# EasyEDA Pro project ProProject_MSPM0L1306转接板_2024-08-03.epro

# Schematic Schematic1
Create Date: 2024-06-29; Page Name: P1; Project Name: MSPM0L1306转接板; Schematic Name: Schematic1; Update Date: 2024-08-02; Company: 嘉立创EDA; Page Size: A3; Version: V1.0
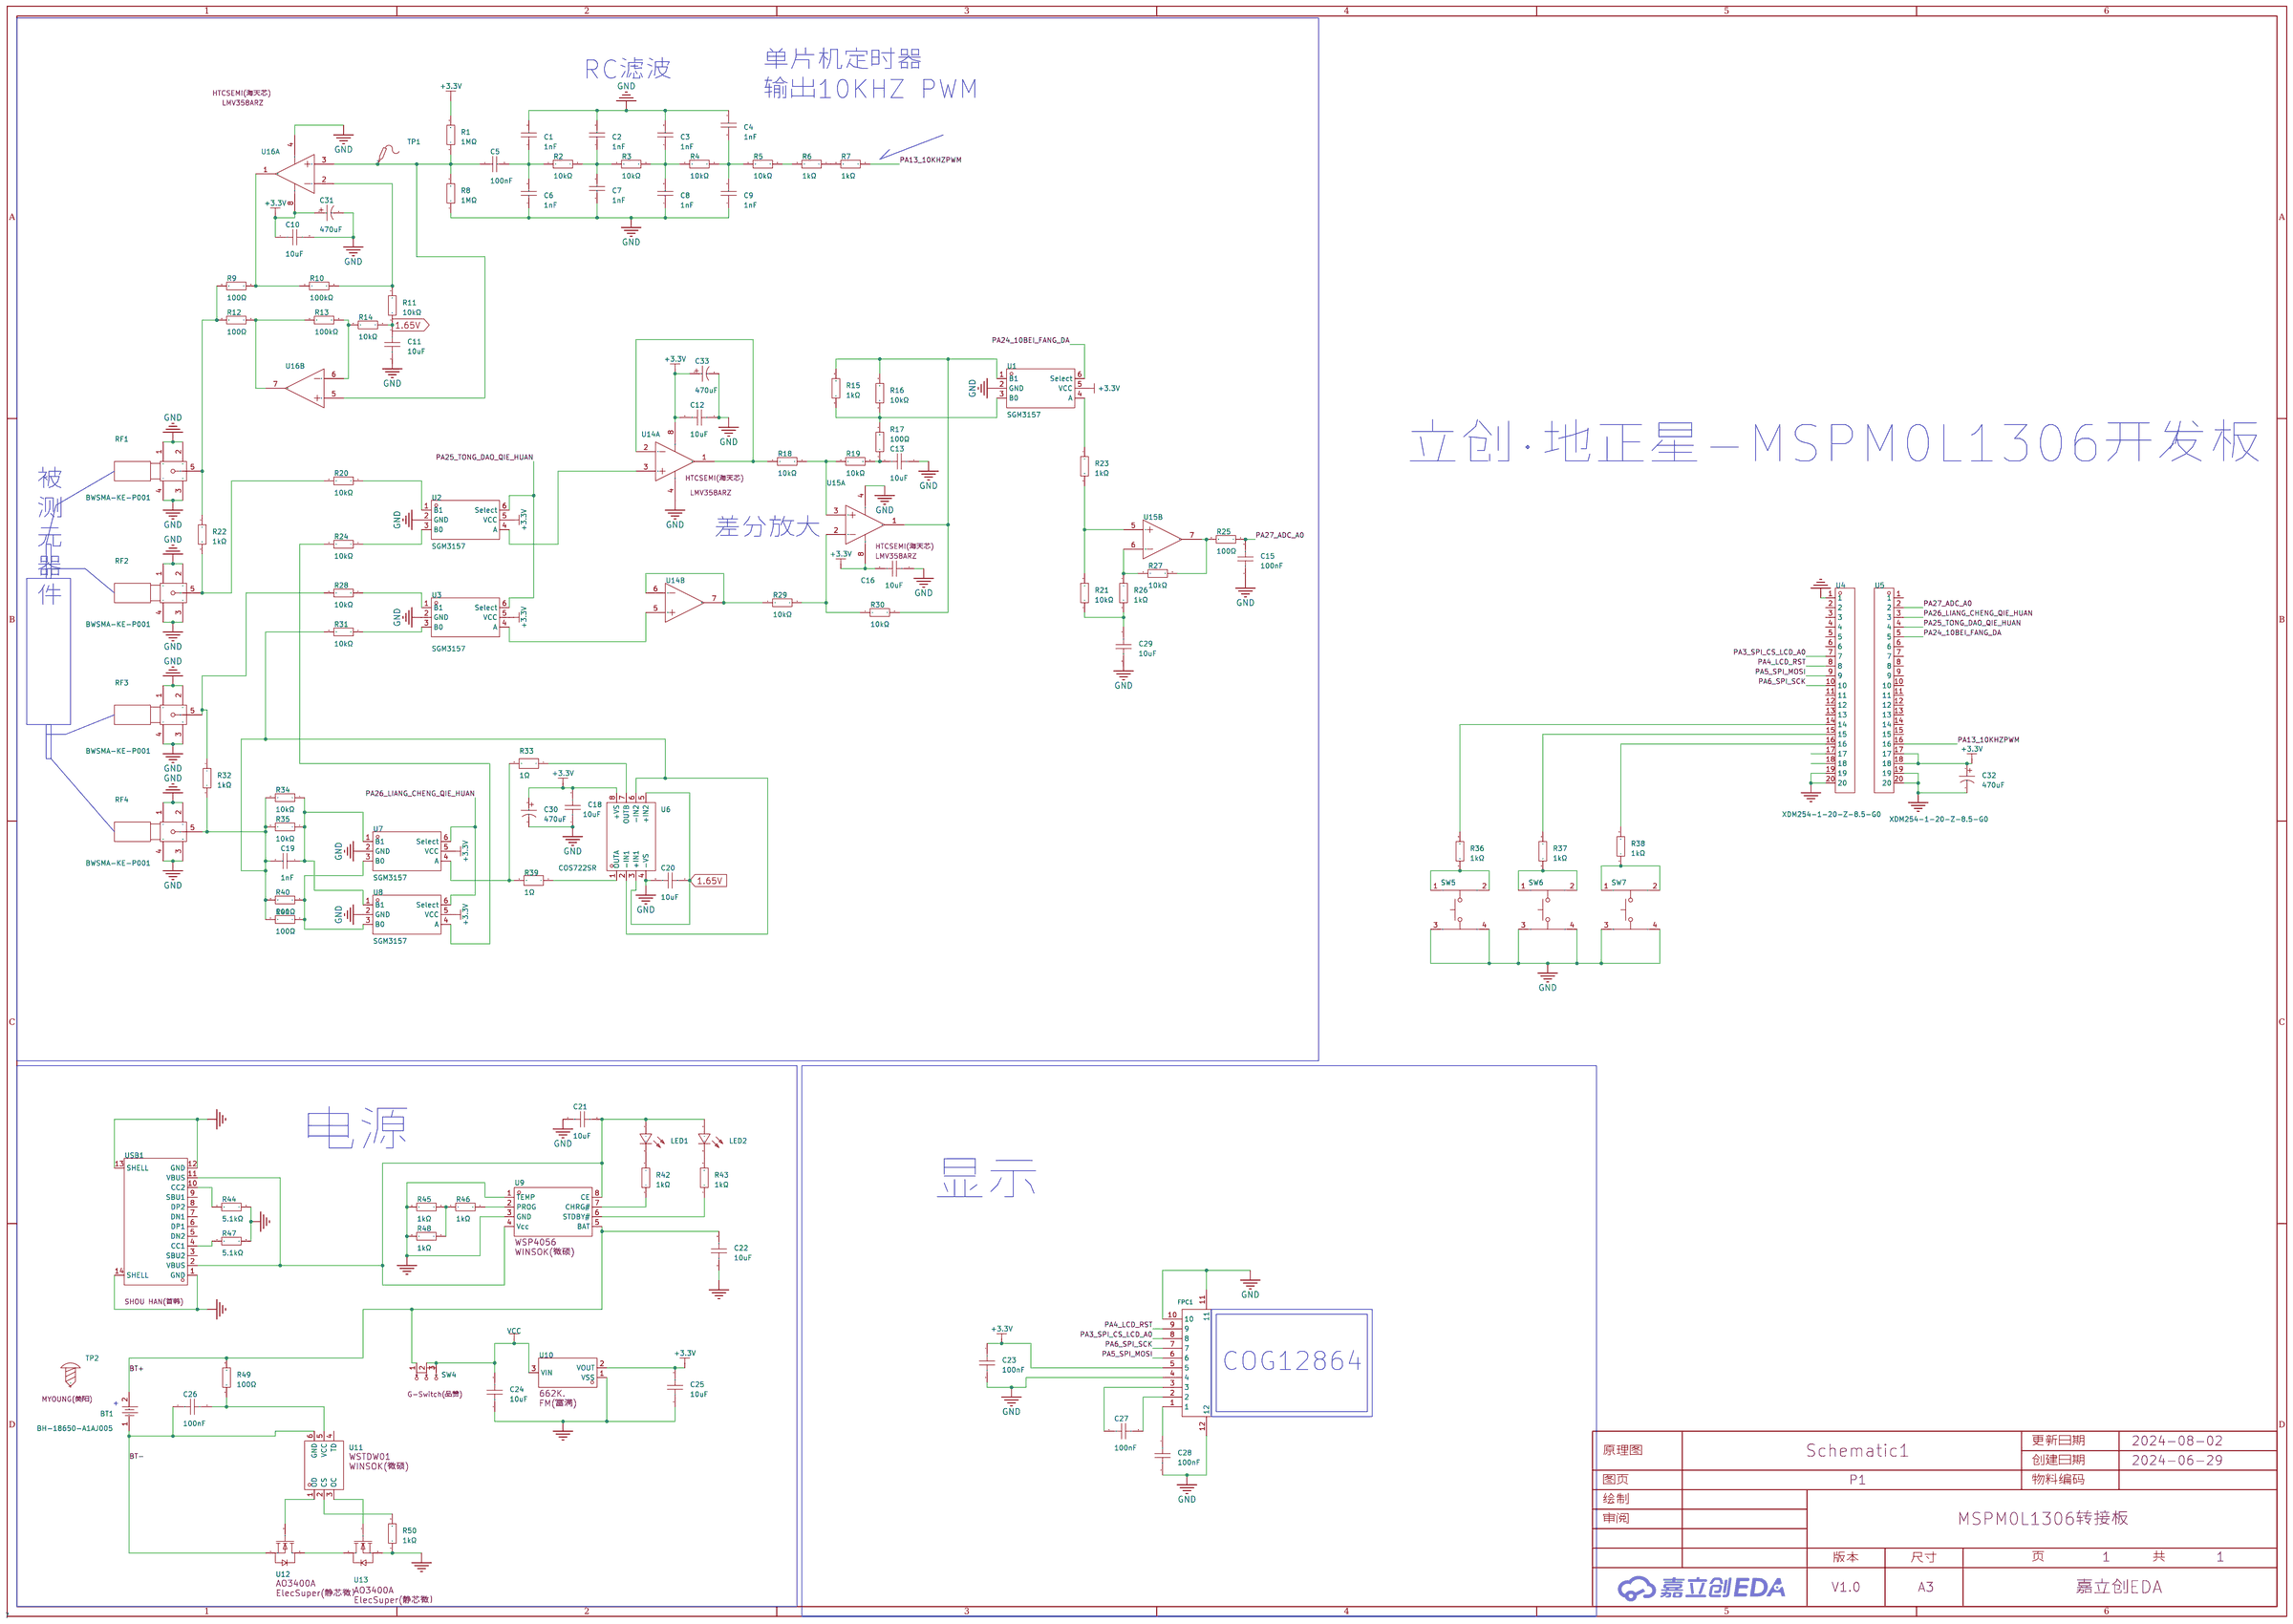
[diagram p0: schematic sheet]

## Parts
BT1  BH-18650-A1AJ005  [BAT-TH_BH-18650-A1AJ005]
C1  1nF  [C0603]
C2  1nF  [C0603]
C3  1nF  [C0603]
C4  1nF  [C0603]
C5  100nF  [C0603]
C6  1nF  [C0603]
C7  1nF  [C0603]
C8  1nF  [C0603]
C9  1nF  [C0603]
C10  10uF  [C0603]
C11  10uF  [C0603]
C12  10uF  [C0603]
C13  10uF  [C0603]
C15  100nF  [C0603]
C16  10uF  [C0603]
C18  10uF  [C0603]
C19  1nF  [C0603]
C20  10uF  [C0603]
C21  10uF  [C0603]
C22  10uF  [C0603]
C23  100nF  [C0603]
C24  10uF  [C0603]
C25  10uF  [C0603]
C26  100nF  [C0603]
C27  100nF  [C0603]
C28  100nF  [C0603]
C29  10uF  [C0603]
C30  470uF  [CAP-TH_BD8.0-P3.50-D0.6-FD]
C31  470uF  [CAP-TH_BD8.0-P3.50-D0.6-FD]
C32  470uF  [CAP-TH_BD8.0-P3.50-D0.6-FD]
C33  470uF  [CAP-TH_BD8.0-P3.50-D0.6-FD]
FPC1  -  [FPC-SMD_10P-P1.0_FGS-XJ-H2.0]
LED1  204-10SURD/S530-A3-L  [LED-TH_BD3.0-P2.54-FD]
LED2  204-10SURD/S530-A3-L  [LED-TH_BD3.0-P2.54-FD]
R1  1MΩ  [R0603]
R2  10kΩ  [R0603]
R3  10kΩ  [R0603]
R4  10kΩ  [R0603]
R5  10kΩ  [R0603]
R6  1kΩ  [R0603]
R7  1kΩ  [R0603]
R8  1MΩ  [R0603]
R9  100Ω  [R0603]
R10  100kΩ  [R0603]
R11  10kΩ  [R0603]
R12  100Ω  [R0603]
R13  100kΩ  [R0603]
R14  10kΩ  [R0603]
R15  1kΩ  [R0603]
R16  10kΩ  [R0603]
R17  100Ω  [R0603]
R18  10kΩ  [R0603]
R19  10kΩ  [R0603]
R20  10kΩ  [R0603]
R21  10kΩ  [R0603]
R22  1kΩ  [R0603]
R23  1kΩ  [R0603]
R24  10kΩ  [R0603]
R25  100Ω  [R0603]
R26  1kΩ  [R0603]
R27  10kΩ  [R0603]
R28  10kΩ  [R0603]
R29  10kΩ  [R0603]
R30  10kΩ  [R0603]
R31  10kΩ  [R0603]
R32  1kΩ  [R0603]
R33  1Ω  [R0603]
R34  10kΩ  [R0603]
R35  10kΩ  [R0603]
R36  1kΩ  [R0603]
R37  1kΩ  [R0603]
R38  1kΩ  [R0603]
R39  1Ω  [R0603]
R40  100Ω  [R0603]
R41  100Ω  [R0603]
R42  1kΩ  [R0603]
R43  1kΩ  [R0603]
R44  5.1kΩ  [R0603]
R45  1kΩ  [R0603]
R46  1kΩ  [R0603]
R47  5.1kΩ  [R0603]
R48  1kΩ  [R0603]
R49  100Ω  [R0603]
R50  1kΩ  [R0603]
RF1  BWSMA-KE-P001  [SMA-SMD_BWSMA-KE-P001]
RF2  BWSMA-KE-P001  [SMA-SMD_BWSMA-KE-P001]
RF3  BWSMA-KE-P001  [SMA-SMD_BWSMA-KE-P001]
RF4  BWSMA-KE-P001  [SMA-SMD_BWSMA-KE-P001]
SW4  SS-12F20-G070  [SW-TH_G-SWITCH_SS-12F20-G070]
SW5  -  [SW-TH_4P-L6.0-W6.0-P3.90-LS6.5]
SW6  -  [SW-TH_4P-L6.0-W6.0-P3.90-LS6.5]
SW7  -  [SW-TH_4P-L6.0-W6.0-P3.90-LS6.5]
TP1  -  [Test-Point-0.5mm]
TP2  -  [M3螺丝]
U1  SGM3157  [SC-70-6_L2.2-W1.3-P0.65-LS2.1-BL]
U2  SGM3157  [SC-70-6_L2.2-W1.3-P0.65-LS2.1-BL]
U3  SGM3157  [SC-70-6_L2.2-W1.3-P0.65-LS2.1-BL]
U4  XDM254-1-20-Z-8.5-G0  [HDR-TH_20P-P2.54-V-F-2]
U5  XDM254-1-20-Z-8.5-G0  [HDR-TH_20P-P2.54-V-F-2]
U6  COS722SR  [SOIC-8_L4.9-W3.9-P1.27-LS6.0-BL]
U7  SGM3157  [SC-70-6_L2.2-W1.3-P0.65-LS2.1-BL]
U8  SGM3157  [SC-70-6_L2.2-W1.3-P0.65-LS2.1-BL]
U9  WSP4056  [SOP-8_L5.1-W3.9-P1.27-LS6.0-BL]
U10  662K.  [SOT-23-3_L2.9-W1.3-P1.90-LS2.4-BR]
U11  WSTDW01  [SOT-23-6_L2.9-W1.6-P0.95-LS2.8-BR]
U12  AO3400A  [SOT-23-3_L3.0-W1.6-P1.90-LS2.8-BR]
U13  AO3400A  [SOT-23-3_L3.0-W1.6-P1.90-LS2.8-BR]
U14  -  [SOP-8_L4.9-W3.9-P1.27-LS6.0-BL]  (sections 1,2)
U15  -  [SOP-8_L4.9-W3.9-P1.27-LS6.0-BL]  (sections 1,2)
U16  -  [SOP-8_L4.9-W3.9-P1.27-LS6.0-BL]  (sections 1,2)
USB1  TYPE-C16PIN2MD(073)  [USB-C-SMD_TYPE-C-6PIN-2MD-073]

## Library data of the parts
BT1 = BH-18650-A1AJ005: 连接器类型:电池盒;适用电池规格:CR18650;触点电镀:镍;工作温度范围:-10℃~+100℃;; LCSC Part Name: 电池盒 适用电池:CR18650; Supplier Part: C5290176; Manufacturer: MYOUNG(美阳); JLCPCB Part Class: 扩展库; Datasheet: https://atta.szlcsc.com/upload/public/pdf/source/20221129/D0CEC1B107B5F52E469FD9B49033E00F.pdf; Supplier: LCSC; Connector Type: 电池盒; Battery Type: CR18650; Contact Plating: 镍; Operating Temperature Range: -10℃~+100℃
C1-C4 C6-C9 C19 = CC0603JRNPO9BN102: 容值:1nF;精度:±5%;额定电压:50V;材质(温度系数):NP0;; LCSC Part Name: 1nF±5%50V; Supplier Part: C106246; Manufacturer: YAGEO(国巨); Supplier Footprint: 0603; JLCPCB Part Class: ExtendedPart; Datasheet: https://atta.szlcsc.com/upload/public/pdf/source/20170505/1493957838062.pdf; Supplier: LCSC; Tolerance: ±5%; Voltage Rated: 50V; Temperature Coefficient: NP0
C5 = 0603B104K500NT: 容值:100nF;精度:±10%;额定电压:50V;材质(温度系数):X7R;; LCSC Part Name: 100nF ±10% 50V; Supplier Part: C30926; Manufacturer: FH(风华); Supplier Footprint: 0603; JLCPCB Part Class: Extended Part; Datasheet: https://atta.szlcsc.com/upload/public/pdf/source/20200305/C486355_26A10D38EF8C2A5C37091D0039909270.pdf; Supplier: LCSC; Tolerance: ±10%; Voltage Rated: 50V; Temperature Coefficient: X7R
C10-C13 C16 C18 C20-C22 C24 C25 C29 = CL10A106KP8NNNC: 容值:10uF;精度:±10%;额定电压:10V;材质(温度系数):X5R;; LCSC Part Name: 10uF ±10% 10V; Supplier Part: C19702; Manufacturer: SAMSUNG(三星); Supplier Footprint: 0603; JLCPCB Part Class: 基础库; Datasheet: https://atta.szlcsc.com/upload/public/pdf/source/20160218/1457707763339.pdf; Supplier: LCSC; Tolerance: ±10%; Voltage Rated: 10V; Temperature Coefficient: X5R
C15 C23 C26-C28 = CC0603KRX7R9BB104: 容值:100nF;精度:±10%;额定电压:50V;材质(温度系数):X7R;; LCSC Part Name: 100nF±10%50V; Supplier Part: C14663; Manufacturer: YAGEO(国巨); Supplier Footprint: 0603; JLCPCB Part Class: BasicPart; Datasheet: https://atta.szlcsc.com/upload/public/pdf/source/20180910/C282072_33301C7F631E79921B82A8DAC6BCC5B3.pdf; Supplier: LCSC; Tolerance: ±10%; Voltage Rated: 50V; Temperature Coefficient: X7R
C30-C33 = KM477M016F12RR0VH2FP0: 容值:470uF;精度:±20%;额定电压:16V;; LCSC Part Name: 470uF±20%16V; Supplier Part: C28067; Manufacturer: CX(承兴); Supplier Footprint: 插件,D8xL12mm; JLCPCB Part Class: ExtendedPart; Datasheet: https://atta.szlcsc.com/upload/public/pdf/source/20211027/06D6BA3719C264B639DC286D935D03EA.pdf; Supplier: LCSC; Tolerance: ±20%; Rated Voltage: 16V; φD: 8mm; L: 12mm; Lead Spacing: 3.5mm; Lifetime @ Temp: 2000hrs@105℃
FPC1 = AFA01-S10FCA-00: 间距:1mm;触点数量:10;锁定特性:翻盖式;安装类型:卧贴;触点类型:下接;; LCSC Part Name: FPC1.0MM10P翻盖式H2.0mm下接; Supplier Part: C262756; Manufacturer: JS(钜硕电子); Supplier Footprint: P=1mm; JLCPCB Part Class: ExtendedPart; Supplier: LCSC; Pitch: 1mm; Number of Contacts: 10; Locking Feature: 翻盖式; Mounting Type: 卧贴; Contact Type: 下接; Height Above Board: 2mm; FFC, FCB Thickness: 0.3mm~0.3mm
LED1 LED2 = 204-10SURD/S530-A3-L: 发光颜色:红灯;二极管配置:-;主波长:624nm;色温:-;功率:60mW;安装方式:-;; LCSC Part Name: 红灯; Supplier Part: C99771; Manufacturer: EVERLIGHT(亿光); Supplier Footprint: 插件,D=3mm; JLCPCB Part Class: ExtendedPart; Datasheet: https://atta.szlcsc.com/upload/public/pdf/source/20170504/1493866972127.pdf; Supplier: LCSC; Emitted Color: 红灯; Lens Color: 雾状红; Dominant Wavelength: 624nm; Peak Wavelength: 632nm; Forward Current: 20mA; Power Dissipation: 60mW; Viewing Angle: 40°; Operating Temperature: -40℃~+85℃; Lamp Holder Type: 3mm圆形灯头
R1 R8 = 0603WAF1004T5E: 电阻类型:厚膜电阻;阻值:1MΩ;精度:±1%;功率:100mW;; LCSC Part Name: 1MΩ±1%100mW; Supplier Part: C22935; Manufacturer: UNI-ROYAL(厚声); Supplier Footprint: 0603; JLCPCB Part Class: BasicPart; Datasheet: https://atta.szlcsc.com/upload/public/pdf/source/20200306/C422600_1E6D84923E4A46A82E41ADD87F860B5C.pdf; Supplier: LCSC; Type: 厚膜电阻; Tolerance: ±1%; Power(Watts): 100mW; Temperature Coefficient: ±100ppm/℃; Overload Voltage (Max): 75V; Operating Temperature Range: -55℃~+155℃
R2-R5 R11 R14 R16 R18-R21 R24 R27-R31 R34 R35 R44 R47 = RC0603FR-0710KL: 电阻类型:厚膜电阻;阻值:10kΩ;精度:±1%;功率:100mW;; LCSC Part Name: 10kΩ±1%100mW; Supplier Part: C98220; Manufacturer: YAGEO(国巨); Supplier Footprint: 0603; JLCPCB Part Class: ExtendedPart; Datasheet: https://atta.szlcsc.com/upload/public/pdf/source/20170522/1495423494387.pdf; Supplier: LCSC; Type: 厚膜电阻; Tolerance: ±1%; Power(Watts): 100mW; Temperature Coefficient: ±100ppm/℃; Overload Voltage (Max): 75V; Operating Temperature Range: -55℃~+155℃
R6 R7 R15 R22 R23 R26 R32 R36-R38 R42 R43 R45 R46 R48 R50 = RC0603FR-071KL: 电阻类型:厚膜电阻;阻值:1kΩ;精度:±1%;功率:100mW;; LCSC Part Name: 1kΩ±1%100mW; Supplier Part: C22548; Manufacturer: YAGEO(国巨); Supplier Footprint: 0603; JLCPCB Part Class: ExtendedPart; Datasheet: https://atta.szlcsc.com/upload/public/pdf/source/20180312/7BD3618A8B6324EA6280B0497A051AB7.pdf; Supplier: LCSC; Type: 厚膜电阻; Tolerance: ±1%; Power(Watts): 100mW; Temperature Coefficient: ±100ppm/℃; Overload Voltage (Max): 75V; Operating Temperature Range: -55℃~+155℃
R9 R12 R17 R25 R40 R41 R49 = RC0603FR-07100RL: 电阻类型:厚膜电阻;阻值:100Ω;精度:±1%;功率:100mW;; LCSC Part Name: 100Ω±1%100mW; Supplier Part: C105588; Manufacturer: YAGEO(国巨); Supplier Footprint: 0603; JLCPCB Part Class: ExtendedPart; Datasheet: https://atta.szlcsc.com/upload/public/pdf/source/20170428/1493376742308.pdf; Supplier: LCSC; Type: 厚膜电阻; Tolerance: ±1%; Power(Watts): 100mW; Temperature Coefficient: ±100ppm/℃; Overload Voltage (Max): 75V; Operating Temperature Range: -55℃~+155℃
R10 R13 = RC0603FR-07100KL: 电阻类型:厚膜电阻;阻值:100kΩ;精度:±1%;功率:100mW;; LCSC Part Name: 100kΩ±1%100mW; Supplier Part: C14675; Manufacturer: YAGEO(国巨); Supplier Footprint: 0603; JLCPCB Part Class: ExtendedPart; Datasheet: https://atta.szlcsc.com/upload/public/pdf/source/20140324/1457707028752.pdf; Supplier: LCSC; Type: 厚膜电阻; Tolerance: ±1%; Power(Watts): 100mW; Temperature Coefficient: ±100ppm/℃; Overload Voltage (Max): 75V; Operating Temperature Range: -55℃~+155℃
R33 R39 = SCR0603F1R: 阻值:1Ω;精度:±1%;; LCSC Part Name: 1Ω ±1%; Supplier Part: C3016186; Manufacturer: VO(翔胜); Supplier Footprint: 0603; JLCPCB Part Class: Extended Part; Datasheet: https://atta.szlcsc.com/upload/public/pdf/source/20220513/247AF9639BA21CF93567DC289CCC6A22.pdf; Supplier: LCSC; Tolerance: ±1%
RF1-RF4 = BWSMA-KE-P001: 连接器类型:板端;接口类型:内孔;端口数量:1;接口直径:5.2mm;接口长度/高度:-;频率-最大值:-;射频系列:SMA;阻抗:50Ω;样式:偏脚;工作温度范围:-;; LCSC Part Name: 内孔 SMA 偏脚; Supplier Part: C496550; Manufacturer: BAT WIRELESS(蝙蝠无线); Supplier Footprint: 插件; JLCPCB Part Class: 扩展库; Datasheet: https://atta.szlcsc.com/upload/public/pdf/source/20240320/28FD502871C976DFF213ABFCF2A0ED51.pdf; Supplier: LCSC; Connector Type: 板端; Interface Type: 内孔; Number of Ports: 1; Interface Diameter: 5.2mm; RF Series: SMA; Impedance: 50Ω; Style: 偏脚
SW4 = SS-12F20-G070: 额定电流(DC):500mA;额定电压(DC):250V;电路结构:单刀双掷;安装方式:直插;机械寿命:-;开关颜色:黑色;; LCSC Part Name: 柄长7mm直插两档滑动开关; Supplier Part: C2848914; Manufacturer: G-Switch(品赞); Supplier Footprint: 插件; JLCPCB Part Class: ExtendedPart; Datasheet: https://atta.szlcsc.com/upload/public/pdf/source/20210825/E0137178672C137814869A76188F885C.pdf; Supplier: LCSC; Current Rating (DC): 500mA; Voltage Rating (DC): 250V; Circuit: 单刀双掷; Mounting Style: 直插; Actuator Color: 黑色; Actuator Style: 矩形柱状; Pin Style: PC引脚; Switch Length: 11.5mm; Switch Width: 5.8mm; Switch Height: 12mm
SW5-SW7 = 1TS005A-2500-5001: 触点电流:50mA;额定电压(DC):12V;额定功率:0.6W;绝缘电阻:100MΩ;电路结构:单刀单掷;安装方式:直插;带灯:无;作用力:250gf@±50gf;机械寿命:7万次;带支架:否;; LCSC Part Name: 6*6*5mm直插轻触开关; Supplier Part: C255811; Manufacturer: HYP(鸿源精密); Supplier Footprint: 插件,6x6mm; JLCPCB Part Class: ExtendedPart; Datasheet: https://atta.szlcsc.com/upload/public/pdf/source/20180720/C255811_DA12C4E3C20854D48E888AEA64926F5F.pdf; Supplier: LCSC; Contact Current: 50mA; Voltage Rating (DC): 12V; Power Rating: 0.6W; Insulation Resistance: 100MΩ; Circuit: 单刀单掷; Mounting Style: 直插; Actuator Style: 圆形按钮; Actuator/Cap Color: 黑色; With Lamp: 无; Operating Force: 250gf@±50gf; Mechanical Life: 7万次; Operating Temperature: -40℃~+90℃; Pin Style: PC引脚; Switch Length: 6mm; Switch Width: 6mm; Switch Height: 5mm; Strike Gundam: 否
TP1 = Test-Point: Test Point 测试点
TP2 = M3螺丝: Supplier Footprint: 插件
U1-U3 U7 U8 = SGM3157: 开关电路:-;; LCSC Part Name: 二选一模拟开关电路; Supplier Part: C394901; Manufacturer: UMW(广东友台半导体); Supplier Footprint: SC-70-6; JLCPCB Part Class: ExtendedPart; Datasheet: https://atta.szlcsc.com/upload/public/pdf/source/20220825/163C0318ED3C3969CBD04552300499AD.pdf; Supplier: LCSC
U4 U5 = XDM254-1-20-Z-8.5-G0: 插孔结构:1x20P;间距:2.54mm;圆孔/方孔:方孔;安装类型:直插;排数:单排;总孔位数:20P;额定电流:3A;插孔方向:顶部;塑高:8.5mm;工作温度范围:-40℃~+105℃;; LCSC Part Name: 1x20P 间距:2.54mm 直插; Supplier Part: C19268713; Manufacturer: XUNDA(讯答); Supplier Footprint: 插件,P=2.54mm; JLCPCB Part Class: Extended Part; Datasheet: https://atta.szlcsc.com/upload/public/pdf/source/20231121/1B5B5C08BA46A4182275D1400A0063D9.pdf; Supplier: LCSC; Holes Structure: 1x20P; Pitch: 2.54mm; Circular Hole / Square Hole: 方孔; Mounting Type: 直插; Number of Rows: 单排; Number of Holes: 20P; Current Rating (Max): 3A; Holes Direction: 顶部; Insulation Height: 8.5mm; Operating Temperature Range: -40℃~+105℃
U6 = COS722SR: 放大器数:双路;增益带宽积(GBP):10MHz;输入失调电压(Vos):5mV;压摆率(SR):7.5V/us;; Supplier Part: C693063; Manufacturer: COSINE(科山芯创); Supplier Footprint: SOIC-8; JLCPCB Part Class: 扩展库; Datasheet: https://atta.szlcsc.com/upload/public/pdf/source/20200629/C693056_2991DE5392421DDCA1474C8C5608148D.pdf; Supplier: LCSC; Number of Circuits: 双路; Gain Bandwidth Product(GBP): 10MHz; Voltage - Input Offset(Vos): 5mV; Slew Rate(SR): 7.5V/us; Supply Current: 650uA
U9 = WSP4056: Supplier Part: C2985892; Manufacturer: WINSOK(微硕); Supplier Footprint: SOP-8; JLCPCB Part Class: ExtendedPart; Supplier: LCSC
U10 = 662K.: 输出类型:-;; LCSC Part Name: 662K; Supplier Part: C841298; Manufacturer: FM(富满); Supplier Footprint: SOT23-3; JLCPCB Part Class: ExtendedPart; Datasheet: https://atta.szlcsc.com/upload/public/pdf/watermark/20200922/C841298_3E220732626B158CD6AC195AF78C7FB8.pdf; Supplier: LCSC
U11 = WSTDW01: 充电电池的类型:-;电池单元组数:-;最大充电电流:-;充满的电池组电压:-;最大供应电压:-;; Supplier Part: C86873; Manufacturer: WINSOK(微硕); Supplier Footprint: SOT-23-6; JLCPCB Part Class: ExtendedPart; Datasheet: https://atta.szlcsc.com/upload/public/pdf/source/20161110/1478743415995.pdf; Supplier: LCSC
U12 U13 = AO3400A_C5224194: 类型:N沟道;漏源电压(Vdss):30V;连续漏极电流(Id):6A;功率(Pd):1.4W;导通电阻(RDS(on)@Vgs,Id):19mΩ@10V,6.0A;; LCSC Part Name: N沟道30V6A; Supplier Part: C5224194; Manufacturer: ElecSuper(静芯微）; Supplier Footprint: SOT-23-3L; JLCPCB Part Class: ExtendedPart; Datasheet: https://atta.szlcsc.com/upload/public/pdf/source/20221027/D95D9171DDBB7BB324532F3AF1EADB7E.pdf; Supplier: LCSC; Type: N沟道; Drain Source Voltage (Vdss): 30V; Continuous Drain Current (Id): 6A; Power Dissipation (Pd): 1.4W; Drain Source On Resistance (RDS(on)@Vgs,Id): 19mΩ@10V,6.0A; Gate Threshold Voltage (Vgs(th)@Id): 1V@250uA
U14-U16 = LMV358ARZ: CMOS低功耗双路运算放大器; Supplier Part: C2928823; Manufacturer: HTCSEMI(海天芯); Supplier Footprint: SOP-8; JLCPCB Part Class: ExtendedPart; Datasheet: https://atta.szlcsc.com/upload/public/pdf/source/20220114/2D4B849A76DE33264688A93B3A90A0F8.pdf; Supplier: LCSC
USB1 = TYPE-C 16PIN 2MD(073): 连接器类型:Type-C;标准:-;公母:母座;触点数量:16;端口数量:1;安装方式:卧贴;额定电流 - 电源:5A;工作温度范围:-25℃~+85℃;; LCSC Part Name: TYPE-C母座16P4脚插件带定位柱不锈钢外壳2次模顶; Supplier Part: C2765186; Manufacturer: SHOU HAN(首韩); Supplier Footprint: SMD; JLCPCB Part Class: ExtendedPart; Datasheet: https://atta.szlcsc.com/upload/public/pdf/source/20211123/39B17C16241EAC15C5E277BDA434118E.pdf; Supplier: LCSC; Connector Type: Type-C; Gender: 母座; Number of Contacts: 16; Number of Ports: 1; Mounting Style: 卧贴; Current Rating - Power (Max): 5A; Operating Temperature Range: -25℃~+85℃

## Nets
1.65V: C11.1 C20.1 R11.1 R14.1 U6.3(+IN1) U6.5(+IN2)
+3.3V: C10.1 C12.2 C16.2 C18.2 C23.1 C25.2 C30.1 C31.1 C32.1 C33.1 FPC1.5 R1.2 U1.5(VCC) U2.5(VCC) U3.5(VCC) U5.17 U5.18 U6.8(+VS) U7.5(VCC) U8.5(VCC) U10.2(VOUT) U14.8(VCC) U15.8(VCC) U16.8(VCC)
GND: C1.2 C2.2 C3.2 C4.2 C6.1 C7.1 C8.1 C9.1 C10.2 C11.2 C12.1 C13.2 C15.1 C16.1 C18.1 C20.2 C21.1 C22.1 C23.2 C24.1 C25.1 C28.2 C29.2 C30.2 C31.2 C32.2 C33.2 FPC1.4 FPC1.10 FPC1.11 FPC1.12 R8.1 R44.2 R45.2 R47.2 R48.2 R50.1 RF1.1 RF1.2 RF1.3 RF1.4 RF2.1 RF2.2 RF2.3 RF2.4 RF3.1 RF3.2 RF3.3 RF3.4 RF4.1 RF4.2 RF4.3 RF4.4 SW5.3 SW5.4 SW6.3 SW6.4 SW7.3 SW7.4 U1.2(GND) U2.2(GND) U3.2(GND) U4.1 U4.19 U4.20 U5.19 U5.20 U6.4(-VS) U7.2(GND) U8.2(GND) U9.1(TEMP) U9.3(GND) U10.1(VSS) U13.2(S) U14.4(GND) U15.4(GND) U16.4(GND) USB1.1(GND) USB1.12(GND) USB1.13(SHELL) USB1.14(SHELL)
VCC: C24.2 SW4.2 SW4.3 U10.3(VIN)
BT+: BT1.2 C22.2 R49.2 SW4.1 U9.5(BAT)
BT-: BT1.1 C26.1 U11.6(GND) U12.2(S)
PA3_SPI_CS_LCD_A0: FPC1.8 U4.7
PA4_LCD_RST: FPC1.9 U4.8
PA5_SPI_MOSI: FPC1.6 U4.9
PA6_SPI_SCK: FPC1.7 U4.10
PA13_10KHZPWM: R7.1 U5.16
PA24_10BEI_FANG_DA: U1.6(Select) U5.5
PA25_TONG_DAO_QIE_HUAN: U2.6(Select) U3.6(Select) U5.4
PA26_LIANG_CHENG_QIE_HUAN: U5.3 U7.6(Select) U8.6(Select)
PA27_ADC_A0: C15.2 R25.1 U5.2
$1N4458: R29.1 U14.6(IN2-) U14.7(OUT2)
$1N4459: R18.1 U14.1(OUT) U14.2(IN1-)
$1N4471: R29.2 R30.1 U15.2(IN1-)
$1N5388: C2.1 C7.2 R2.2 R3.1
$1N5389: C3.1 C8.2 R3.2 R4.1
$1N5390: C4.1 C9.2 R4.2 R5.1
$1N5392: C1.1 C5.2 C6.2 R2.1
$1N5393: R5.2 R6.2
$1N5453: R9.1 R10.1 U16.1(OUT)
$1N5457: R10.2 R11.2 U16.2(IN1-)
$1N5553: R13.2 R14.2 U16.6(IN2-)
$1N5656: R12.1 R13.1 U16.7(OUT2)
$1N7059: U12.3(D) U13.3(D)
$1N7060: U11.1(OD) U12.1(G)
$1N7061: U11.3(OC) U13.1(G)
$1N7062: R50.2 U11.2(CS)
$1N7064: R46.1 U9.2(PROG)
$1N7066: R42.1 U9.7(CHRG#)
$1N7067: R43.1 U9.6(STDBY#)
$1N7068: R47.1 USB1.4(CC1)
$1N7069: R44.1 USB1.10(CC2)
$1N7073: C26.2 R49.1 U11.5(VCC)
$1N7080: R45.1 R46.2 R48.1
$1N7081: C21.2 LED1.1(A) LED2.1(A) U9.4(Vcc) U9.8(CE) USB1.2(VBUS) USB1.11(VBUS)
$1N7083: LED1.2(K) R42.2
$1N7084: LED2.2(K) R43.2
$1N7990: R33.1 U6.7(OUTB)
$1N7994: R39.1 U6.1(OUTA)
$1N8746: R40.1 R41.1 U7.3(B0) U8.3(B0)
$1N8820: C5.1 R1.1 R8.2 TP1.1 U16.3(IN1+) U16.5(IN2+)
$1N9182: R33.2 R39.2 U7.4(A)
$1N9199: R18.2 R19.1 U15.3(IN1+)
$1N9268: R25.2 R27.2 U15.7(OUT2)
$1N9446: R28.1 U3.1(B1)
$1N9447: R20.1 U2.1(B1)
$1N9448: R31.1 U3.3(B0)
$1N9449: R24.1 U2.3(B0)
$1N9718: R24.2 U8.4(A)
$1N10353: U3.4(A) U14.5(IN2+)
$1N10358: U2.4(A) U14.3(IN1+)
$1N10407: R15.2 R16.2 R30.2 U1.1(B1) U15.1(OUT)
$1N10420: R15.1 R16.1 R17.2 U1.3(B0)
$1N10921: C28.1 FPC1.1
$1N10922: C27.2 FPC1.2
$1N10923: C27.1 FPC1.3
$1N11049: R6.1 R7.2
$1N14605: C19.1 R34.1 R35.1 U7.1(B1) U8.1(B1)
$1N14739: R9.2 R12.2 R22.1 RF1.5
$1N14745: R20.2 R22.2 RF2.5
$1N14751: R28.2 R32.1 RF3.5
$1N14766: C19.2 R31.2 R32.2 R34.2 R35.2 R40.2 R41.2 RF4.5 U6.2(-IN1) U6.6(-IN2)
$1N18202: R38.2 U4.16
$1N18206: R37.2 U4.15
$1N18210: R36.2 U4.14
$1N18396: R26.1 R27.1 U15.6(IN2-)
$1N18471: C13.1 R17.1 R19.2
$1N18482: C29.1 R21.1 R26.2
$1N18491: R23.1 U1.4(A)
$1N18530: R21.2 R23.2 U15.5(IN2+)
$1N22517: R36.1 SW5.1 SW5.2
$1N22556: R37.1 SW6.1 SW6.2
$1N22633: R38.1 SW7.1 SW7.2

Not connected (* = marked no-connect by the designer): TP2 1; U4 2 3 4 5 6 11 12 13 17 18; U5 1 6 7 8 9 10 11 12 13 14 15; U11 4(TD); USB1 3(SBU2) 5(DN2) 6(DP1) 7(DN1) 8(DP2) 9(SBU1)

## Notes on the sheet
- RC滤波
- 单片机定时器
  输出10KHZ PWM
- 立创·地正星-MSPM0L1306开发板
- 差分放大
- 被
  测
  元
  器
  件
- 电源
- 显示
- COG12864
- +

# Board PCB10
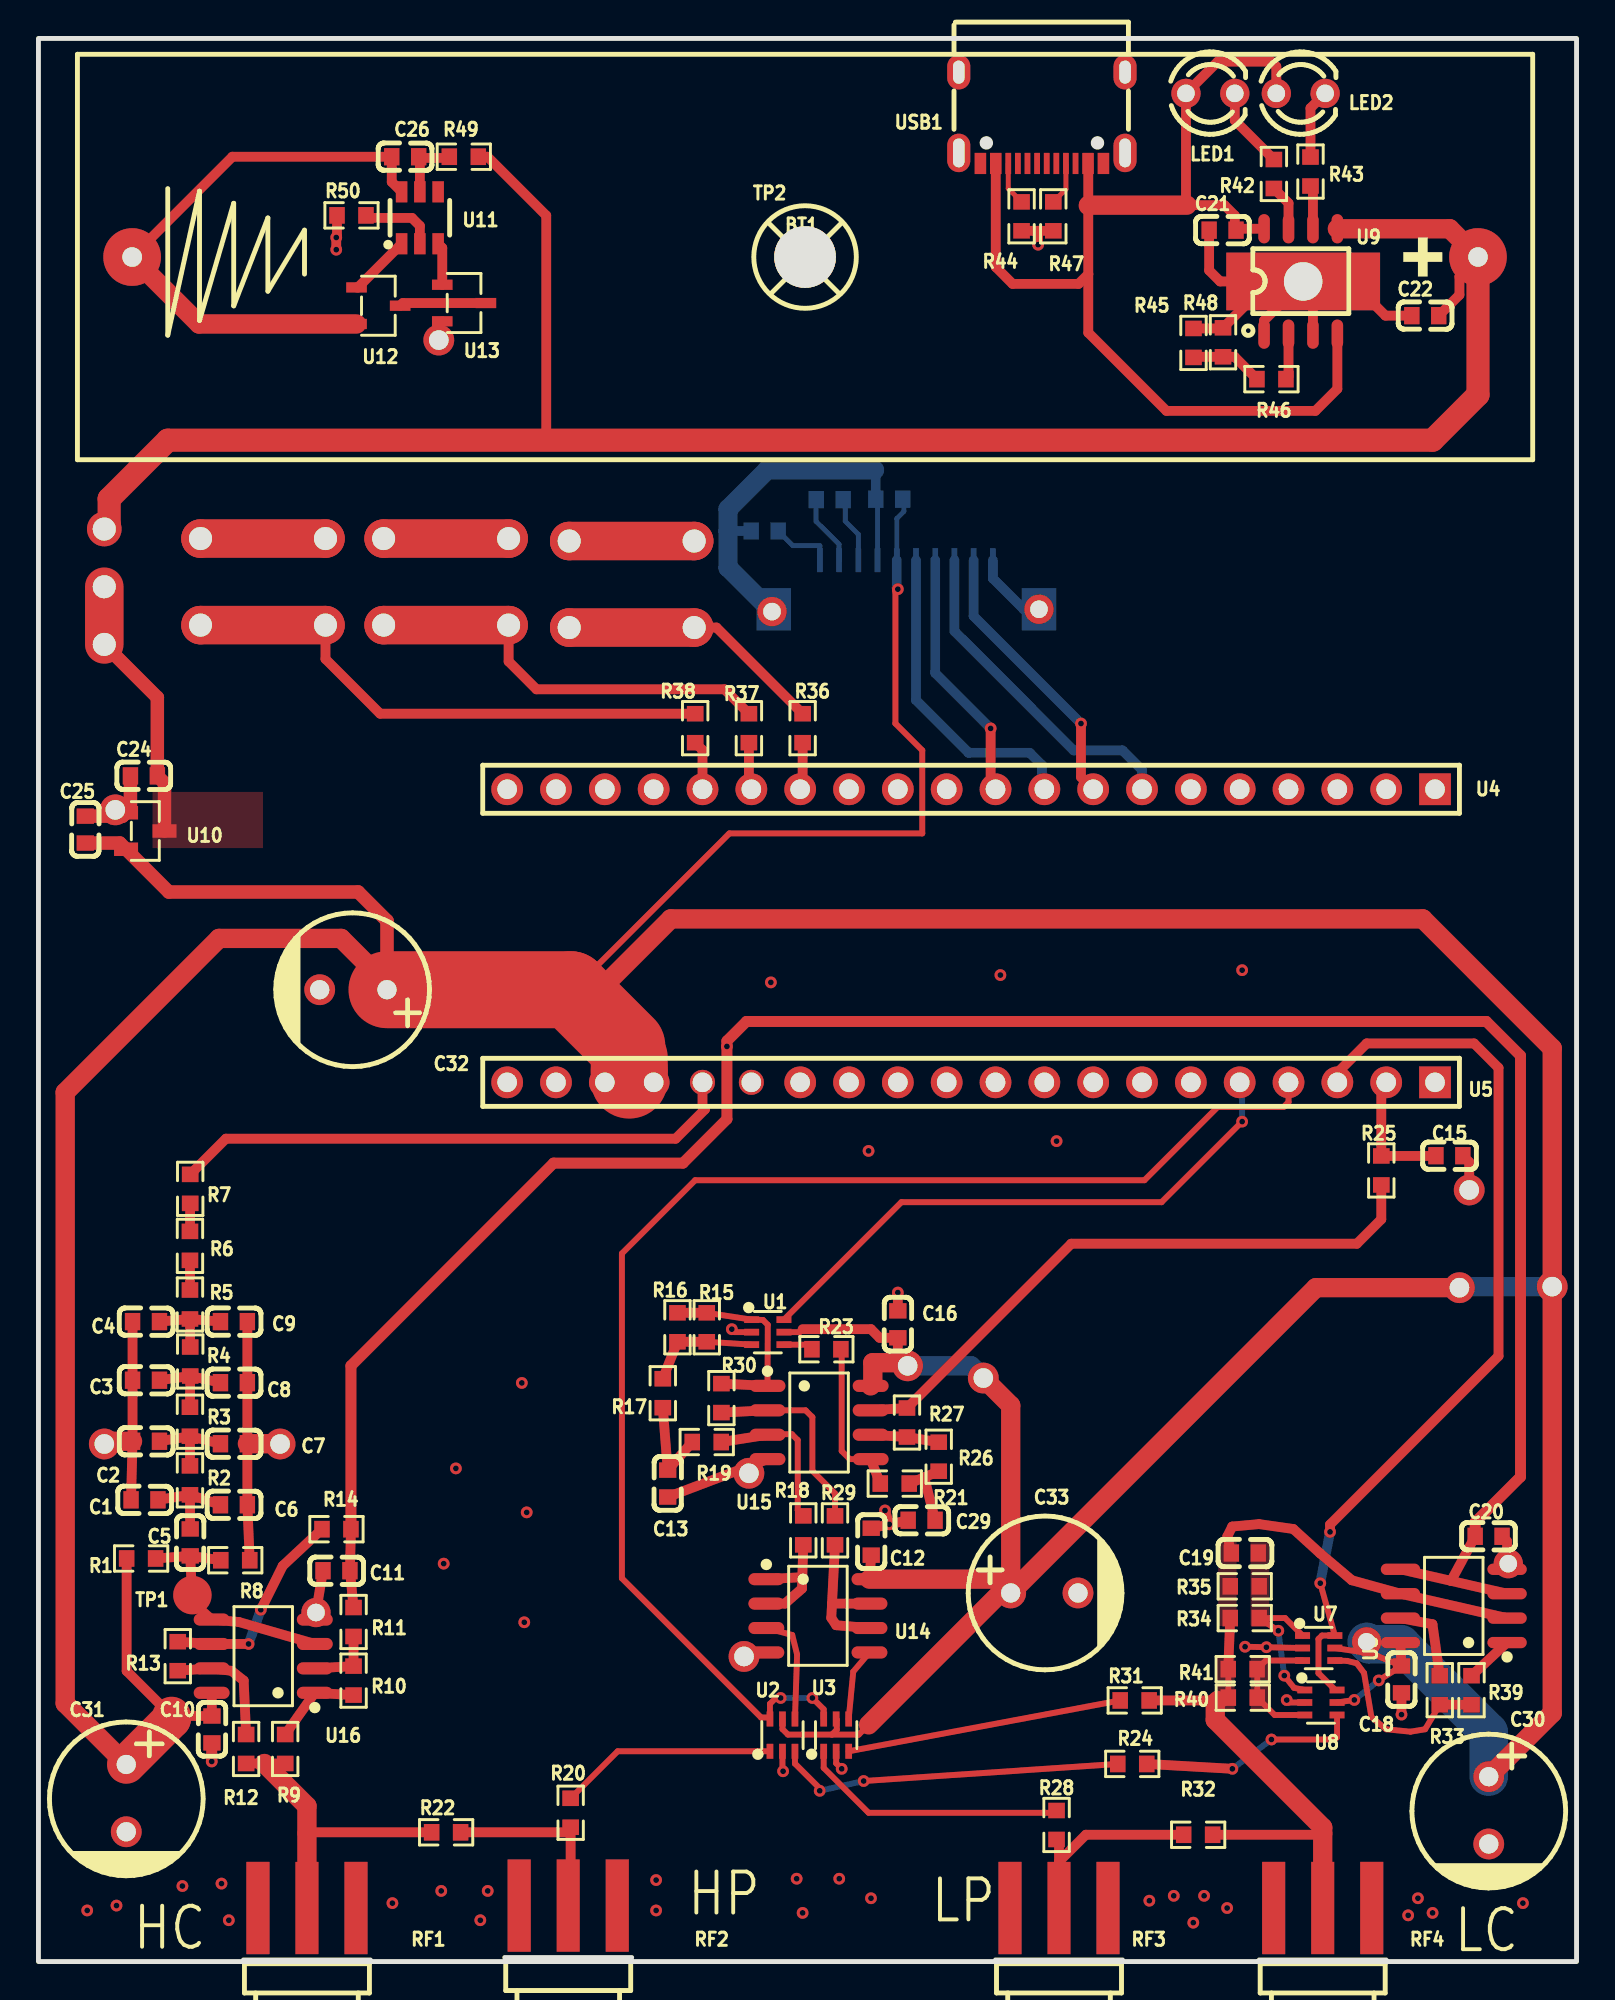
[diagram p1: board, top side]
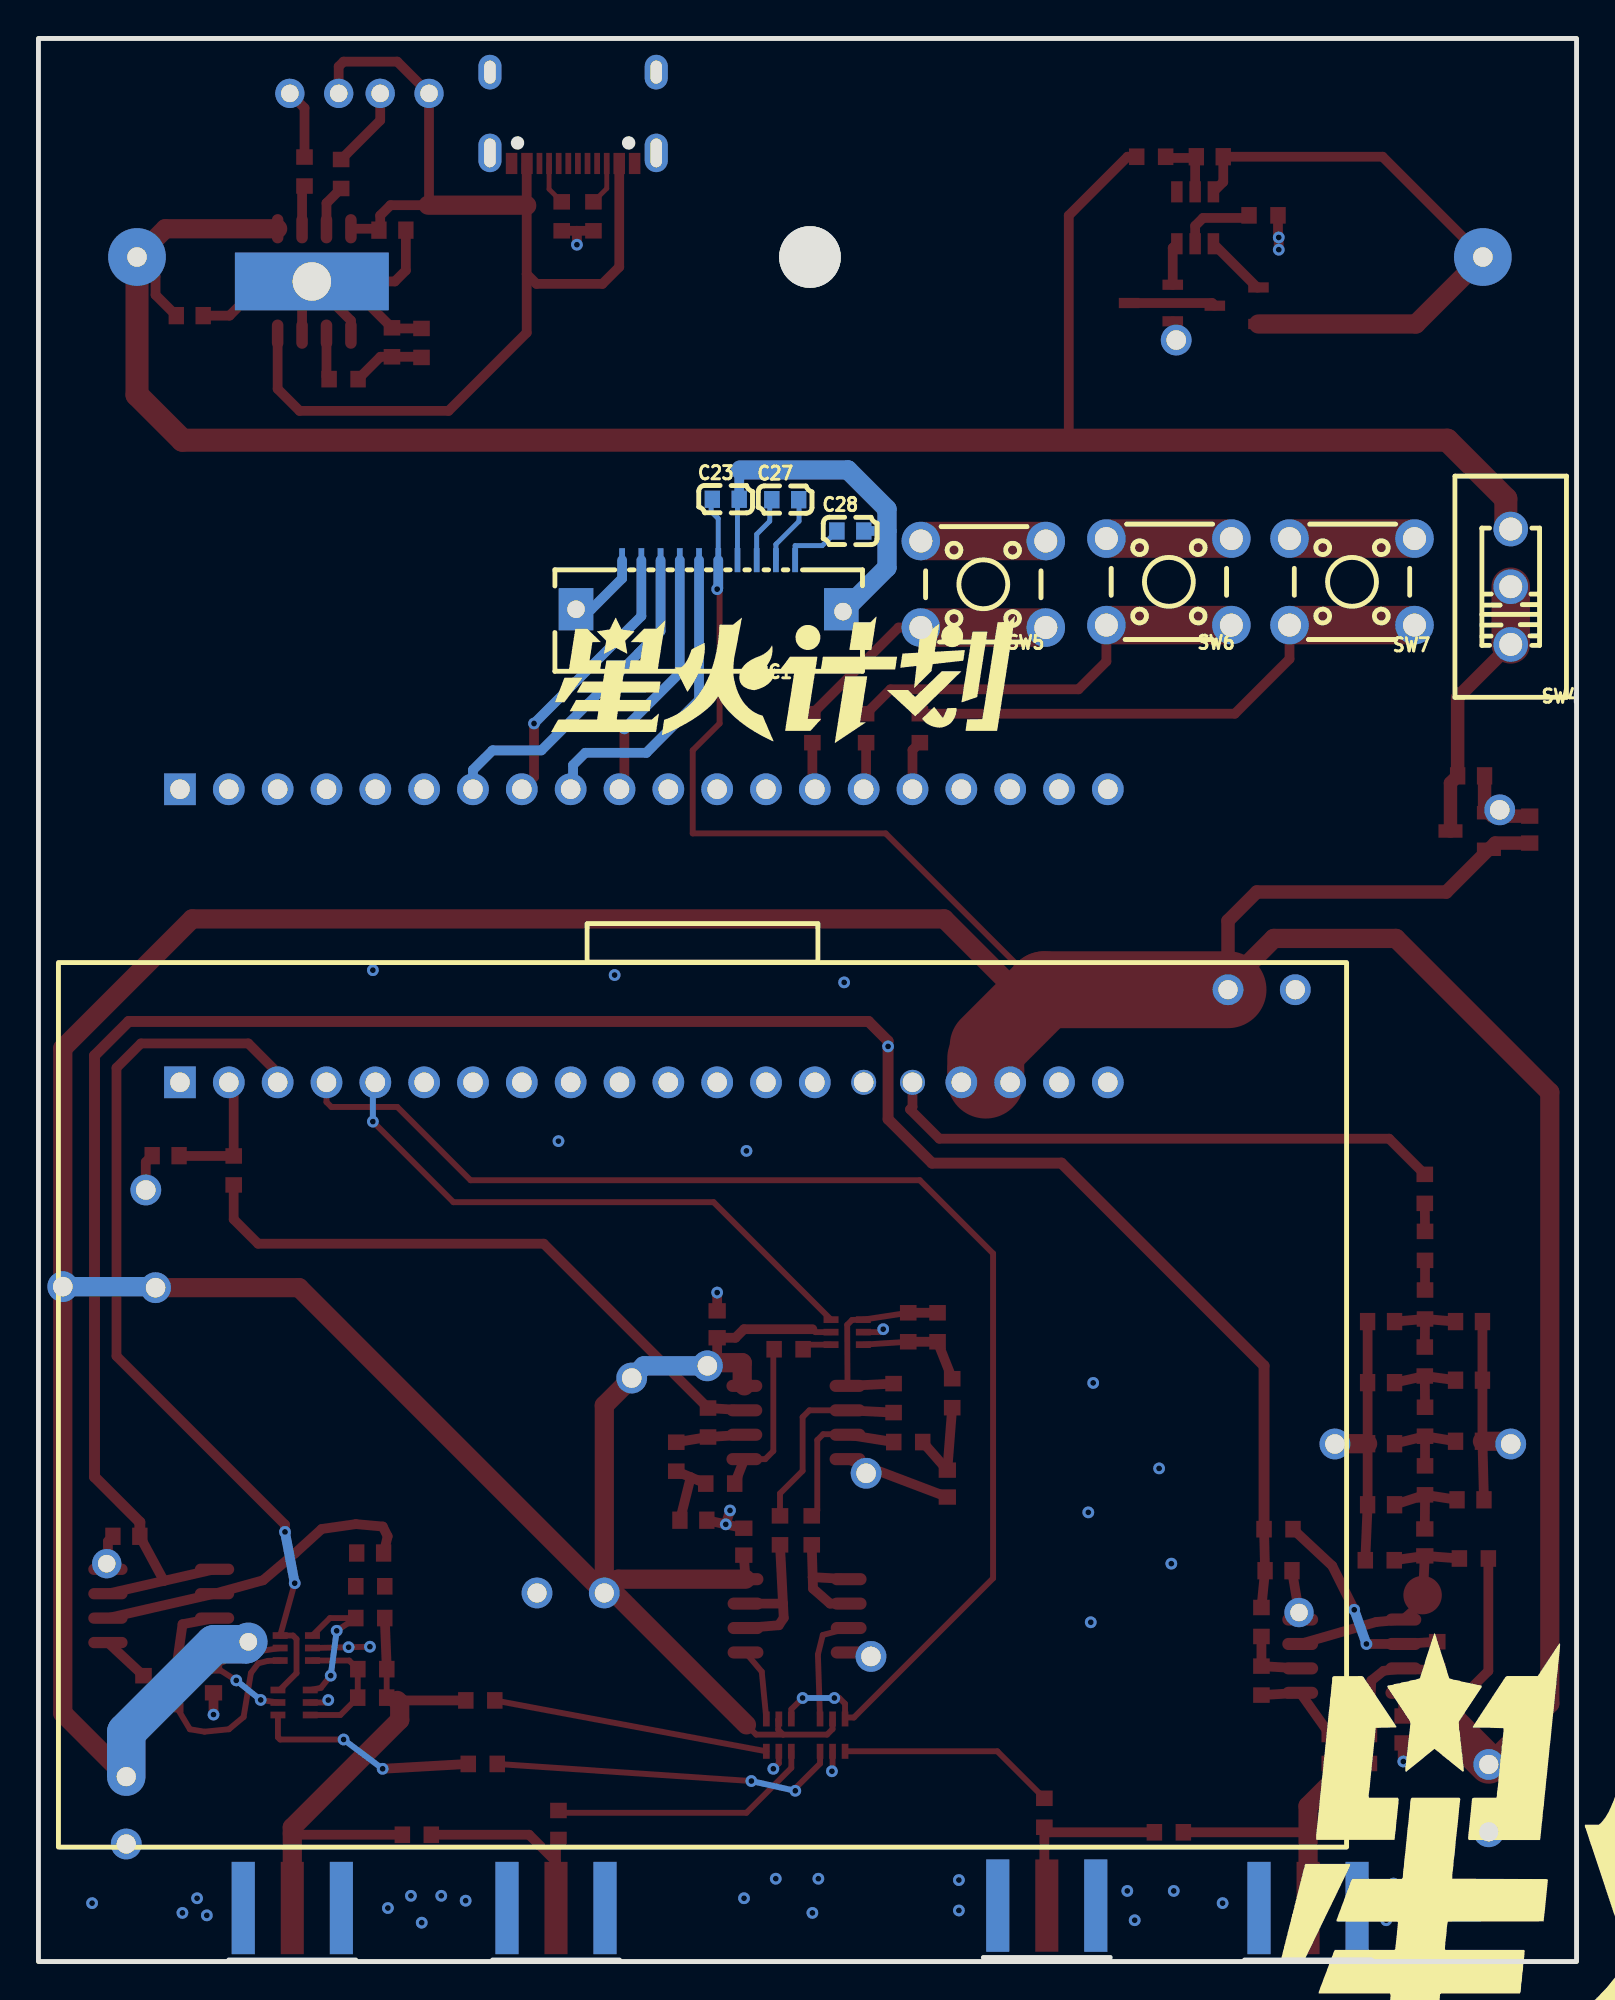
[diagram p2: board, bottom side, seen from below]

Outline 80 x 100 mm; copper layers: Top Layer, Bottom Layer. Coordinates in mm from the lower left corner of the outline.
Outline path: rectangle 0,100 80,0
Stack: Top Layer 0.035mm / Dielectric1 1.51mm FR4 er 4.5 / Bottom Layer 0.035mm

## Design rules (mm)
template: 自定义配置
spacing copperThickness1oz (default): track to track 0.102, other pairs 0.152 to 0.3
spacing copperThickness2oz: track to track 0.203, other pairs 0.152 to 0.3
track width copperThickness1oz (default): min 0.127, default 0.254, max 2.54
track width copperThickness2oz: min 0.203, default 0.254, max 2.54
differential pair differentialPair (default): width min 0.127, default 0.254, max 2.54; gap min 0.152, default 0.152
via viaSize (default): diameter min 0.5, default 0.61, max 10; hole min 0.3, default 0.305, max 6.3

## Placement (name value [footprint] x y rotation side)
BT1  BH-18650-A1AJ005  [bat-th_bh-18650-a1aj005]  39.87 88.64 0 top
C1  1nF  [C0603]  5.52 24.01 180 top
C2  1nF  [C0603]  5.59 27.05 180 top
C3  1nF  [C0603]  5.59 30.23 180 top
C4  1nF  [C0603]  5.59 33.28 180 top
C5  100nF  [C0603]  7.89 21.8 90 top
C6  1nF  [C0603]  10.17 23.75 180 top
C7  1nF  [C0603]  10.17 26.93 180 top
C8  1nF  [C0603]  10.17 30.1 180 top
C9  1nF  [C0603]  10.17 33.28 180 top
C10  10uF  [C0603]  9.02 12.07 270 top
C11  10uF  [C0603]  15.5 20.32 180 top
C12  10uF  [C0603]  43.31 21.83 270 top
C13  10uF  [C0603]  32.73 24.85 270 top
C15  100nF  [C0603]  73.39 41.9 180 top
C16  10uF  [C0603]  44.7 33.14 270 top
C18  10uF  [C0603]  70.9 14.67 90 top
C19  1nF  [C0603]  62.75 21.24 180 top
C20  10uF  [C0603]  75.43 22.11 0 top
C21  10uF  [C0603]  61.59 90.03 0 top
C22  10uF  [C0603]  72.13 85.59 0 top
C23  100nF  [C0603]  44.25 76.04 180 bottom
C24  10uF  [C0603]  5.48 61.66 0 top
C25  10uF  [C0603]  2.44 58.86 270 top
C26  100nF  [C0603]  19.08 93.85 0 top
C27  100nF  [C0603]  41.16 76.02 180 bottom
C28  100nF  [C0603]  37.77 74.39 180 bottom
C29  10uF  [C0603]  45.94 22.95 180 top
C30  470uF  [CAP-TH_BD8.0-P3.50-D0.6-FD]  75.43 7.86 270 top
C31  470uF  [CAP-TH_BD8.0-P3.50-D0.6-FD]  4.57 8.5 270 top
C32  470uF  [CAP-TH_BD8.0-P3.50-D0.6-FD]  16.38 50.53 180 top
C33  470uF  [CAP-TH_BD8.0-P3.50-D0.6-FD]  52.32 19.17 0 top
FPC1  -  [FPC-SMD_10P-P1.0_FGS-XJ-H2.0]  45.14 71.59 0 bottom
LED1  204-10SURD/S530-A3-L  [LED-TH_BD3.0-P2.54-FD]  60.96 97.14 0 top
LED2  204-10SURD/S530-A3-L  [LED-TH_BD3.0-P2.54-FD]  65.65 97.14 0 top
NOREF  -  [Pad_e918]  12.57 26.91 0 top
NOREF#2  -  [Pad_e931]  65.78 87.37 0 top
NOREF#3  -  [Pad_e279]  69.08 16.63 0 top
NOREF#4  -  [Pad_e896]  36.7 15.86 0 top
NOREF#5  -  [Pad_e904]  36.95 25.39 0 top
NOREF#6  -  [Pad_e137]  38.15 70.2 0 top
NOREF#7  -  [Pad_e286]  76.45 20.69 0 top
NOREF#8  -  [Pad_e869]  45.21 30.98 0 top
NOREF#9  -  [Pad_e1382]  20.82 84.32 180 top
NOREF#10  -  [Pad_e832]  78.74 35.1 0 top
NOREF#11  -  [Pad_e138]  52.04 70.32 0 top
NOREF#12  -  [Pad_e871]  49.14 30.34 0 top
NOREF#13  -  [Pad_e288]  14.43 18.15 0 top
NOREF#14  -  [Pad_e836]  73.91 35.04 0 top
NOREF#15  -  [Pad_e921]  3.42 26.91 0 top
NOREF#16  -  [Pad_e409]  4 59.89 0 top
NOREF#17  -  [Pad_e552]  74.42 40.12 0 top
R1  1MΩ  [R0603]  5.34 20.96 180 top
R2  10kΩ  [R0603]  7.88 25.02 90 top
R3  10kΩ  [R0603]  7.88 28.07 90 top
R4  10kΩ  [R0603]  7.89 31.2 90 top
R5  10kΩ  [R0603]  7.88 34.17 90 top
R6  1kΩ  [R0603]  7.88 37.21 270 top
R7  1kΩ  [R0603]  7.89 40.18 270 top
R8  1MΩ  [R0603]  10.23 20.87 180 top
R9  100Ω  [R0603]  12.83 11.05 270 top
R10  100kΩ  [R0603]  16.39 14.61 90 top
R11  10kΩ  [R0603]  16.39 17.66 270 top
R12  100Ω  [R0603]  10.8 11.05 270 top
R13  100kΩ  [R0603]  7.25 15.88 90 top
R14  10kΩ  [R0603]  15.5 22.48 180 top
R15  1kΩ  [R0603]  34.76 32.98 90 top
R16  10kΩ  [R0603]  33.24 32.98 90 top
R17  100Ω  [R0603]  32.47 29.55 90 top
R18  10kΩ  [R0603]  39.78 22.42 90 top
R19  10kΩ  [R0603]  34.76 27.01 180 top
R20  10kΩ  [R0603]  27.68 7.74 270 top
R21  10kΩ  [R0603]  44.54 24.85 180 top
R22  1kΩ  [R0603]  21.2 6.72 0 top
R23  1kΩ  [R0603]  40.98 31.84 0 top
R24  10kΩ  [R0603]  56.89 10.28 0 top
R25  100Ω  [R0603]  69.84 41.14 270 top
R26  1kΩ  [R0603]  46.82 26.25 270 top
R27  10kΩ  [R0603]  45.17 28.03 90 top
R28  10kΩ  [R0603]  52.95 7.1 270 top
R29  10kΩ  [R0603]  41.43 22.42 90 top
R30  10kΩ  [R0603]  35.52 29.3 90 top
R31  10kΩ  [R0603]  57.02 13.58 0 top
R32  1kΩ  [R0603]  60.32 6.59 0 top
R33  1Ω  [R0603]  72.89 14.11 270 top
R34  10kΩ  [R0603]  62.74 17.86 180 top
R35  10kΩ  [R0603]  62.74 19.51 180 top
R36  1kΩ  [R0603]  39.75 64.13 270 top
R37  1kΩ  [R0603]  36.95 64.13 270 top
R38  1kΩ  [R0603]  34.16 64.13 270 top
R39  1Ω  [R0603]  74.54 14.11 270 top
R40  100Ω  [R0603]  62.64 13.72 180 top
R41  100Ω  [R0603]  62.63 15.2 180 top
R42  1kΩ  [R0603]  64.26 92.95 90 top
R43  1kΩ  [R0603]  66.16 93.08 90 top
R44  5.1kΩ  [R0603]  51.13 90.75 270 top
R45  1kΩ  [R0603]  60.08 84.17 90 top
R46  1kΩ  [R0603]  64.13 82.28 180 top
R47  5.1kΩ  [R0603]  52.78 90.75 270 top
R48  1kΩ  [R0603]  61.61 84.2 90 top
R49  100Ω  [R0603]  22.12 93.85 0 top
R50  1kΩ  [R0603]  16.28 90.8 0 top
RF1  BWSMA-KE-P001  [SMA-SMD_BWSMA-KE-P001]  13.97 2.78 270 top
RF2  BWSMA-KE-P001  [SMA-SMD_BWSMA-KE-P001]  27.55 2.91 270 top
RF3  BWSMA-KE-P001  [SMA-SMD_BWSMA-KE-P001]  53.08 2.78 270 top
RF4  BWSMA-KE-P001  [SMA-SMD_BWSMA-KE-P001]  66.8 2.78 270 top
SW4  SS-12F20-G070  [SW-TH_G-SWITCH_SS-12F20-G070]  3.42 71.49 270 bottom
SW5  -  [SW-TH_4P-L6.0-W6.0-P3.90-LS6.5]  30.86 71.62 0 bottom
SW6  -  [SW-TH_4P-L6.0-W6.0-P3.90-LS6.5]  21.2 71.74 0 bottom
SW7  -  [SW-TH_4P-L6.0-W6.0-P3.90-LS6.5]  11.68 71.74 0 bottom
TP1  -  [test-point-0.5mm]  8.01 19.05 90 top
TP2  -  [M3螺丝]  39.94 88.57 0 top
U1  SGM3157  [SC-70-6_L2.2-W1.3-P0.65-LS2.1-BL]  37.94 32.73 270 top
U2  SGM3157  [SC-70-6_L2.2-W1.3-P0.65-LS2.1-BL]  38.7 11.77 0 top
U3  SGM3157  [SC-70-6_L2.2-W1.3-P0.65-LS2.1-BL]  41.49 11.77 0 top
U4  XDM254-1-20-Z-8.5-G0  [HDR-TH_20P-P2.54-V-F-2]  48.51 60.96 180 top
U5  XDM254-1-20-Z-8.5-G0  [hdr-th_20p-p2.54-v-f-2]  48.51 45.72 180 top
U6  COS722SR  [SOIC-8_L4.9-W3.9-P1.27-LS6.0-BL]  73.61 18.49 90 top
U7  SGM3157  [SC-70-6_L2.2-W1.3-P0.65-LS2.1-BL]  66.59 16.3 270 top
U8  SGM3157  [SC-70-6_L2.2-W1.3-P0.65-LS2.1-BL]  66.7 13.47 270 top
U9  WSP4056  [SOP-8_L5.1-W3.9-P1.27-LS6.0-BL]  65.65 87.37 0 top
U10  662K.  [SOT-23-3_L2.9-W1.3-P1.90-LS2.4-BR]  5.56 58.79 180 top
U11  WSTDW01  [SOT-23-6_L2.9-W1.6-P0.95-LS2.8-BR]  19.84 90.67 270 top
U12  AO3400A  [SOT-23-3_L3.0-W1.6-P1.90-LS2.8-BR]  17.68 86.1 180 top
U13  AO3400A  [SOT-23-3_L3.0-W1.6-P1.90-LS2.8-BR]  22.14 86.24 180 top
U14  -  [SOP-8_L4.9-W3.9-P1.27-LS6.0-BL]  40.54 17.98 270 top
U15  -  [SOP-8_L4.9-W3.9-P1.27-LS6.0-BL]  40.6 28.03 270 top
U16  -  [SOP-8_L4.9-W3.9-P1.27-LS6.0-BL]  11.69 15.88 90 top
USB1  TYPE-C16PIN2MD(073)  [USB-C-SMD_TYPE-C-6PIN-2MD-073]  52.19 95.87 180 top

## Footprints (pads in the part's own frame, mm; a bottom-side part is the same pattern mirrored in y, then rotated)
bat-th_bh-18650-a1aj005
  round 3 hole 1.02: 1(-35,0) 2(35,0)
C0603
  rect 0.8x0.9 smd: 1(-0.7,0) 2(0.7,0)
CAP-TH_BD8.0-P3.50-D0.6-FD
  round 1.6 hole 1: 1(-1.75,0) 2(1.75,0)
FPC-SMD_10P-P1.0_FGS-XJ-H2.0
  rect 0.3x1.25 smd: 1(-4.497,-1.276) 2(-3.498,-1.276) 3(-2.498,-1.276) 4(-1.497,-1.276) 5(-0.497,-1.276) 6(0.502,-1.276) 7(1.502,-1.276) 8(2.503,-1.276) 9(3.502,-1.274) 10(4.503,-1.274)
  rect 1.8x2.2 smd: 11(-6.9,1.276) 12(6.9,1.276)
hdr-th_20p-p2.54-v-f-2
  rect 1.65x1.65 hole 1.02: 1(-24.13,0)
  round 1.65 hole 1.02: 2(-21.59,0) 3(-19.05,0) 4(-16.51,0) 5(-13.97,0) 6(-11.43,0) 7(-8.89,0) 8(-6.35,0) 9(-3.81,0) 10(-1.27,0) 11(1.27,0) 12(3.81,0) 13(6.35,0) 14(8.89,0) 17(16.51,0) 18(19.05,0) 19(21.59,0) 20(24.13,0)
  round 1.3 hole 1.02: 15(11.43,0) 16(13.97,0)
HDR-TH_20P-P2.54-V-F-2
  rect 1.65x1.65 hole 1.02: 1(-24.13,0)
  round 1.65 hole 1.02: 2(-21.59,0) 3(-19.05,0) 4(-16.51,0) 5(-13.97,0) 6(-11.43,0) 7(-8.89,0) 8(-6.35,0) 9(-3.81,0) 10(-1.27,0) 11(1.27,0) 12(3.81,0) 13(6.35,0) 14(8.89,0) 15(11.43,0) 16(13.97,0) 17(16.51,0) 18(19.05,0) 19(21.59,0) 20(24.13,0)
LED-TH_BD3.0-P2.54-FD
  round 1.524 hole 0.914: 1(-1.27,0) 2(1.27,0)
M3螺丝
  round 3.2 hole 3.2: 1(-0.064,0.064)
Pad_e137
  round 1.524 hole 0.914: 21(0,0)
Pad_e138
  round 1.524 hole 0.914: 22(0,0)
Pad_e279
  round 1.524 hole 0.914: 24(0,0)
Pad_e286
  round 1.524 hole 0.914: 25(0,0)
Pad_e288
  round 1.524 hole 0.914: 26(0,0)
Pad_e409
  round 1.6 hole 1.02: 27(0,0)
Pad_e552
  round 1.6 hole 1.02: 28(0,0)
Pad_e832
  round 1.6 hole 1.02: 29(0,0)
Pad_e836
  round 1.6 hole 1.02: 30(0,0)
Pad_e869
  round 1.6 hole 1.02: 31(0,0)
Pad_e871
  round 1.6 hole 1.02: 32(0,0)
Pad_e896
  round 1.6 hole 1.02: 33(0,0)
Pad_e904
  round 1.6 hole 1.02: 34(0,0)
Pad_e918
  round 1.6 hole 1.02: 35(0,0)
Pad_e921
  round 1.6 hole 1.02: 36(0,0)
Pad_e931
  rect 8x3 hole 2: 23(0,0)
Pad_e1382
  round 1.6 hole 1.02: 37(0,0)
R0603
  rect 0.806x0.864 smd: 1(-0.753,0) 2(0.753,0)
SC-70-6_L2.2-W1.3-P0.65-LS2.1-BL
  rect 0.35x0.78 smd: 1(-0.65,-0.84) 2(0,-0.84) 3(0.65,-0.84) 4(0.65,0.84) 5(0,0.84) 6(-0.65,0.84)
SMA-SMD_BWSMA-KE-P001
  rect 4.8x1.2 smd: 1(0,-2.55) 2(0,2.55) 5(0,0)
  rect 4.8x1.2 smd far side: 3(0,2.55) 4(0,-2.55)
SOIC-8_L4.9-W3.9-P1.27-LS6.0-BL
  oval 0.588x2.045 smd: 1(-1.905,-2.772) 2(-0.635,-2.772) 3(0.635,-2.772) 4(1.905,-2.772) 5(1.905,2.772) 6(0.635,2.772) 7(-0.635,2.772) 8(-1.905,2.772)
SOP-8_L4.9-W3.9-P1.27-LS6.0-BL
  oval 0.63x1.865 smd: 1(-1.905,-2.683) 2(-0.635,-2.683) 3(0.635,-2.683) 4(1.905,-2.683) 5(1.905,2.683) 6(0.635,2.683) 7(-0.635,2.683) 8(-1.905,2.683)
SOP-8_L5.1-W3.9-P1.27-LS6.0-BL
  oval 0.6x1.52 smd: 1(-1.905,-2.74) 2(-0.635,-2.74) 3(0.635,-2.74) 4(1.905,-2.74) 5(1.905,2.74) 6(0.635,2.74) 7(-0.635,2.74) 8(-1.905,2.74)
SOT-23-3_L2.9-W1.3-P1.90-LS2.4-BR
  rect 1.25x0.7 smd: 1(1,-0.95) 2(1,0.95) 3(-1,0)
SOT-23-3_L3.0-W1.6-P1.90-LS2.8-BR
  rect 1.07x0.532 smd: 1(1.135,-0.95) 2(1.135,0.95) 3(-1.135,0)
SOT-23-6_L2.9-W1.6-P0.95-LS2.8-BR
  rect 1.1x0.6 smd: 1(1.35,-0.95) 2(1.35,0) 3(1.35,0.95) 4(-1.35,0.95) 5(-1.35,0) 6(-1.35,-0.95)
SW-TH_4P-L6.0-W6.0-P3.90-LS6.5
  round 2 hole 1.2: 1(-3.25,2.25) 2(3.25,2.25) 3(-3.25,-2.25) 4(3.25,-2.25)
SW-TH_G-SWITCH_SS-12F20-G070
  round 1.8 hole 1.2: 1(-3,0) 2(0,0) 3(3,0)
test-point-0.5mm
  round 2 smd: 1(0,0)
USB-C-SMD_TYPE-C-6PIN-2MD-073
  rect 0.6x1.1 smd: 1(-3.2,2.375) 2(-2.4,2.375) 11(2.4,2.375) 12(3.2,2.375)
  rect 0.3x1.1 smd: 3(-1.75,2.375) 4(-1.25,2.375) 5(-0.75,2.375) 6(-0.25,2.375) 7(0.25,2.375) 8(0.75,2.375) 9(1.25,2.375) 10(1.75,2.375)
  oval 1.2x2 hole 0.6x1.5: 13(-4.325,1.825) 14(4.325,1.825)
  oval 1.2x1.8 hole 0.6x1.2: 13(-4.325,-2.375) 14(4.325,-2.375)

## Nets
As in the schematic, except:
+3.3V: C10.1 C12.2 C16.2 C18.2 C23.1 C25.2 C30.1 C31.1 C32.1 C33.1 FPC1.5 NOREF#3.24 NOREF#8.31 NOREF#10.29 NOREF#12.32 NOREF#14.30 R1.2 U1.5 U2.5 U3.5 U5.17 U5.18 U6.8 U7.5 U8.5 U10.2 U14.8 U15.8 U16.8
GND: C1.2 C2.2 C3.2 C4.2 C6.1 C7.1 C8.1 C9.1 C10.2 C11.2 C12.1 C13.2 C15.1 C16.1 C18.1 C20.2 C21.1 C22.1 C23.2 C24.1 C25.1 C28.2 C29.2 C30.2 C31.2 C32.2 C33.2 FPC1.4 FPC1.10 FPC1.11 FPC1.12 NOREF.35 NOREF#2.23 NOREF#4.33 NOREF#5.34 NOREF#6.21 NOREF#7.25 NOREF#9.37 NOREF#11.22 NOREF#13.26 NOREF#15.36 NOREF#16.27 NOREF#17.28 R8.1 R44.2 R45.2 R47.2 R48.2 R50.1 RF1.1 RF1.2 RF1.3 RF1.4 RF2.1 RF2.2 RF2.3 RF2.4 RF3.1 RF3.2 RF3.3 RF3.4 RF4.1 RF4.2 RF4.3 RF4.4 SW5.3 SW5.4 SW6.3 SW6.4 SW7.3 SW7.4 U1.2 U2.2 U3.2 U4.1 U4.19 U4.20 U5.19 U5.20 U6.4 U7.2 U8.2 U9.1 U9.3 U10.1 U13.2 U14.4 U15.4 U16.4 USB1.1 USB1.12 USB1.13 USB1.14

Pads without a net: TP2 1; U4 2 3 4 5 6 11 12 13; U5 1 6 7 8 9 10 11 12 13 14 15; U11 4; USB1 3 5 6 7 8 9

## Via types
v1: diameter 0.61, hole 0.305, Top Layer to Bottom Layer, 67 vias

## Routing (per net, layer and track width the routed paths; a pad name or vN(x,y) marks a point on that pad's centre or on a via; arc(x,y) is an arc through that point)
1.65V: length 118.2
  Top Layer w0.508: 73.47,19.79 U6.5 ; 73.47,19.79 76.39,19.13 ; 73.47,19.79 C20.1 ; R11.1 C11.1 R14.1
  Top Layer w0.568: C20.1 74.73,22.85 77.08,25.2 77.08,47.11 75.31,48.88 36.82,48.88 35.81,47.87 35.81,43.8 33.52,41.52 26.79,41.52 16.25,30.98 R14.1
  vias: v1(35.81,47.59)
+3.3V: length 351.4
  Top Layer w0.305: 41.27,11.8 42.67,11.8 43.18,12.31 43.18,12.44 ; 41.27,11.8 41.52,12.05 41.52,12.58 U3.5 ; 41.27,11.8 38.98,11.8 38.7,12.09 U2.5 ; 39.75,32.88 39.59,32.73 U1.5 ; U8.5 v1(68.44,13.6) ; v1(69.71,14.62) C18.2 69.33,16.02 U7.5
  Top Layer w0.308: 27.68,50.53 27.81,50.53 35.94,58.66 45.97,58.66 45.97,62.98 44.57,64.38 44.57,71.24 v1(44.7,71.36)
  Top Layer w0.508: C18.2 70.89,15.38 U6.8 ; U16.8 C10.1 6.93,12.77 4.59,15.11 R1.2 ; 39.75,32.88 43.3,32.88 43.75,32.44 C16.2 44.7,31.48 45.04,31.14 ; U14.8 C12.2
  Top Layer w0.7: C25.2 4.23,58.16 U10.2 6.78,55.62 16.63,55.62 18.13,54.12 18.13,50.82
  Top Layer w1: U15.8 43.4,30.05 43.4,31.14 45.04,31.14 NOREF#8.31 ; C33.1 49.85,19.88 U14.8 ; C33.1 66.44,35.04 NOREF#14.30 ; C33.1 50.57,28.92 NOREF#12.32 ; C33.1 50.03,19.17 43.18,12.31 ; C32.1 18.13,50.82 15.74,53.2 9.39,53.2 1.39,45.2 1.39,13.42 C31.1 ; U5.17 31.4,46.32 30.73,46.32 30.13,45.72 29.46,45.72 ; C30.1 78.74,12.91 NOREF#10.29 78.74,47.49 72,54.22 32.89,54.22 29.21,50.53
  Top Layer w2: 6.93,12.77 6.93,12.61 C31.1
  Top Layer w4: 30.6,47.61 27.68,50.53 C32.1 ; 30.73,46.98 30.73,45.84
  Bottom Layer w0.254: FPC1.5 44.64,75.03 45.01,75.41 45.01,75.98 C23.1
  Bottom Layer w0.305: v1(68.44,13.6) v1(69.71,14.62)
  Bottom Layer w0.508: v1(44.7,71.36) 44.64,71.42 FPC1.5
  Bottom Layer w1: NOREF#10.29 73.96,35.1 NOREF#14.30 ; NOREF#12.32 48.51,30.98 NOREF#8.31
  Bottom Layer w2: C30.1 75.43,11.93 70.86,16.5 69.21,16.5 NOREF#3.24
GND: length 128.3
  Top Layer w0.305: v1(64.93,13.6) 65.05,13.47 U8.2 ; U1.2 36.22,32.73 v1(36.06,32.88) ; v1(62.76,16.37) v1(63.87,16.34) U7.2
  Top Layer w0.308: U2.2 38.7,9.93 v1(38.73,9.9) ; v1(41.78,10.02) 41.49,10.31 U3.2
  Top Layer w0.508: C18.1 v1(70.9,12.84) ; 51.99,90 v1(51.99,89.28) ; 51.99,90 R44.2 ; 51.99,90 R47.2 ; NOREF#17.28 74.42,41.57 C15.1 ; NOREF#2.23 63.75,85.33 63.75,84.62 ; NOREF#2.23 64.02,87.37 ; NOREF#2.23 66.29,86.86 66.29,84.62 ; NOREF#2.23 68.28,87.37 70.06,85.59 C22.1 ; 10.87,33.28 10.87,23.75 R8.1 ; U6.4 76.39,21.85 C20.2 ; R50.1 15.53,89.69 v1(15.49,89.65) v1(15.49,89.02) ; 64.02,87.37 R48.2 61.58,84.92 R45.2 ; 64.02,87.37 61.46,87.37 60.89,87.94 C21.1 ; C1.2 C2.2 C3.2 C4.2 ; v1(44.7,34.79) C16.1 ; v1(44.25,22.74) v1(44.03,23.46) ; v1(44.25,22.74) C12.1 ; v1(44.25,22.74) C29.2 ; 20.82,84.44 20.82,85.11 U13.2 ; U15.4 C13.2 ; U16.4 C11.2
  Top Layer w0.568: C10.2 9.01,11.36 v1(9.01,10.4)
  Top Layer w0.7: C24.1 4.78,59.96 U10.1 4.38,59.56 C25.1
  Top Layer w1: NOREF#15.36 3.57,27.05 C2.2 ; 10.87,26.93 12.55,26.93 NOREF.35
  Top Layer w2: SW6.4 SW6.3 ; SW5.4 SW5.3 ; SW7.4 SW7.3
  Bottom Layer w0.254: C23.2 43.64,75.95 FPC1.4
  Bottom Layer w0.508: 43.49,77.56 43.55,77.5 C23.2 ; NOREF#11.22 51.24,70.32 49.64,71.92 FPC1.10 ; C28.2 35.87,74.39 35.87,74.39
  Bottom Layer w1: 43.49,77.56 37.9,77.56 35.87,75.53 35.87,72.48 NOREF#6.21
  vias: v1(2.53,2.66) v1(4.06,2.91) v1(7.49,3.93) v1(9.52,4.05) v1(9.9,2.15) v1(18.41,3.04) v1(20.95,3.67) v1(21.08,20.69) v1(21.71,25.64) v1(22.98,2.15) v1(23.37,3.67) v1(25.14,30.09) v1(25.27,17.64) v1(25.4,23.36) v1(32.13,4.24) v1(32.13,2.66) v1(38.09,50.92) v1(39.44,4.31) v1(39.75,2.53) v1(41.65,4.31) v1(43.18,42.15) v1(43.3,3.29) v1(50.03,51.3) v1(52.95,42.66) v1(57.78,3.16) v1(59.05,3.42) v1(60.07,2.02) v1(60.63,3.42) v1(61.82,2.78) v1(62.61,51.55) v1(71.24,2.4) v1(71.75,3.29) v1(72.51,2.53) v1(77.21,3.04)
VCC: length 14
  Top Layer w0.7: U10.3 6.56,61.28 C24.2 6.18,65.73 SW4.3
  Top Layer w2: SW4.2 SW4.3
BT+: length 110.1
  Top Layer w0.508: 26.41,79.49 26.41,90.79 23.35,93.85 R49.2 ; 74.87,88.58 73.91,87.62 73.91,86.67 C22.2
  Top Layer w1: U9.5 73.4,90.11 BT1.2
  Top Layer w1.2: BT1.2 74.87,81.47 72.51,79.11 6.73,79.11 3.68,76.06 3.68,74.74 SW4.1
BT-: length 30.8
  Top Layer w0.508: BT1.1 10.09,93.85 C26.1 18.38,92.54 U11.6
  Top Layer w1: BT1.1 8.36,85.15 U12.2
PA3_SPI_CS_LCD_A0: length 17.4
  Bottom Layer w0.508: FPC1.8 47.64,69.18 53.84,62.98 56.38,62.98 57.4,61.97 U4.7
PA4_LCD_RST: length 14.5
  Top Layer w0.508: 54.86,60.96 54.22,61.59 v1(54.22,64.38)
  Bottom Layer w0.508: FPC1.9 48.64,69.96 v1(54.22,64.38)
PA5_SPI_MOSI: length 16.5
  Bottom Layer w0.508: U4.9 52.19,61.09 52.19,62.22 51.56,62.85 48.38,62.85 45.64,65.59 FPC1.6
PA6_SPI_SCK: length 13.2
  Top Layer w0.508: v1(49.53,64.12) 49.53,61.21 U4.10
  Bottom Layer w0.508: v1(49.53,64.12) 46.64,67.01 FPC1.7
PA13_10KHZPWM: length 29.6
  Top Layer w0.508: U5.16 34.54,44.44 34.67,44.31 33.14,42.79 9.75,42.79 R7.1
PA24_10BEI_FANG_DA: length 30.2
  Top Layer w0.308: U1.6 44.88,39.49 58.41,39.49 v1(62.61,43.68)
  Bottom Layer w0.308: 62.48,45.72 62.61,45.59 v1(62.61,43.68)
PA25_TONG_DAO_QIE_HUAN: length 71
  Top Layer w0.305: v1(38.6,13.71) 38.35,13.71 38.05,13.4 U2.6 ; v1(40.25,13.71) 40.84,13.12 U3.6
  Top Layer w0.308: 65.02,45.72 65.02,44.69 64.76,44.44 61.34,44.44 57.53,40.63 34.16,40.63 30.35,36.82 30.35,19.93 37.59,12.69 37.97,12.69 U2.6
  Bottom Layer w0.305: v1(40.25,13.71) v1(38.6,13.71)
PA26_LIANG_CHENG_QIE_HUAN: length 47.4
  Top Layer w0.305: v1(66.67,19.67) U7.6 66.76,16.95 66.58,16.77 66.58,14.99 67.45,14.12 U8.6
  Top Layer w0.508: U5.3 67.56,46.22 69.08,47.74 74.67,47.74 75.94,46.47 75.94,31.48 67.18,22.72 v1(67.18,22.34)
  Bottom Layer w0.508: v1(67.18,22.34) v1(66.67,19.67)
PA27_ADC_A0: length 6.8
  Top Layer w0.508: C15.2 72.67,41.89 R25.1 69.84,45.47 U5.2
$1N4458: length 8
  Top Layer w0.508: 41.28,18.61 41.24,17.87 41.49,17.49 U14.6 ; 41.28,18.61 R29.1 ; 41.28,18.61 U14.7
$1N4459: length 6.3
  Top Layer w0.508: 39.73,19.99 R18.1 ; 39.73,19.99 39.71,19.39 38.82,18.61 U14.2 ; 39.73,19.99 U14.1
$1N4471: length 10.5
  Top Layer w0.305: U15.2 39.9,28.66 40.25,28.31 40.25,25.52 41.43,24.34 R29.2
  Top Layer w0.508: R30.1 U15.2
$1N5388: length 4.8
  Top Layer w0.508: R2.2 R3.1 ; R3.1 6.3,27.05 ; R3.1 C7.2
$1N5389: length 4.8
  Top Layer w0.508: R3.2 R4.1 ; R4.1 6.3,30.23 ; R4.1 C8.2
$1N5390: length 4.6
  Top Layer w0.508: R5.1 C9.2 ; R5.1 6.3,33.28 ; R5.1 R4.2
$1N5392: length 5.1
  Top Layer w0.508: C5.2 R2.1 ; R2.1 C1.1 ; R2.1 C6.2
$1N5393: length 1.5
  Top Layer w0.508: R5.2 R6.2
$1N5453: length 4.7
  Top Layer w0.508: R10.1 U16.1 R9.1
$1N5457: length 3.6
  Top Layer w0.508: R11.2 R10.2 U16.2
$1N5553: length 10.9
  Top Layer w0.508: v1(11.56,18.29) 12.71,20.58 R14.2 ; R13.2 U16.6 v1(10.93,16.51)
  Bottom Layer w0.508: v1(10.93,16.51) v1(11.56,18.29)
$1N5656: length 6.4
  Top Layer w0.508: R12.1 10.67,14.61 10.04,15.12 U16.7 R13.1
$1N7059: length 4.5
  Top Layer w0.508: U12.3 18.95,86.24 23.27,86.24
$1N7060: length 3.3
  Top Layer w0.508: U11.1 16.62,87.05 16.54,87.05
$1N7061: length 2.2
  Top Layer w0.508: U13.1 21,89.11 U11.3
$1N7062: length 4
  Top Layer w0.508: U11.2 19.84,90.26 19.43,90.67 17.17,90.67 R50.2
$1N7064: length 2.4
  Top Layer w0.508: 65.02,84.62 65.02,82.42 R46.1
$1N7066: length 2.4
  Top Layer w0.508: U9.7 65.02,91.44 R42.1
$1N7067: length 2.3
  Top Layer w0.508: U9.6 66.29,92.2 R43.1
$1N7068: length 2.3
  Top Layer w0.254: USB1.4 53.44,92.16 52.78,91.5
$1N7069: length 2.3
  Top Layer w0.254: 51.13,91.5 50.44,92.2 USB1.10
$1N7073: length 3.4
  Top Layer w0.508: 19.84,93.79 21.31,93.79 R49.1 ; 19.84,93.79 U11.5 ; 19.84,93.79 C26.2
$1N7080: length 3.8
  Top Layer w0.508: R46.2 62.21,83.45 R48.1 60.11,83.45 R45.1
$1N7081: length 60.4
  Top Layer w0.508: USB1.2 54.6,93.49 54.6,87.75 ; 54.6,87.75 54.1,87.24 50.67,87.24 49.79,88.11 USB1.11 ; 54.6,87.75 54.6,84.7 58.67,80.63 66.42,80.63 67.56,81.78 67.56,84.62 ; U9.8 62.36,90.11 C21.2 62.22,90.1 62.22,90.79 61.69,91.33 59.73,91.33 59.69,91.38 LED1.1 61.34,98.8 64.13,98.8 64.38,98.54 LED2.1
  Top Layer w1: 59.73,91.33 54.63,91.33 54.6,91.31
$1N7083: length 4.3
  Top Layer w0.508: 62.22,97.14 62.22,95.74 R42.2
$1N7084: length 3.6
  Top Layer w0.508: R43.2 66.16,96.38 LED2.2
$1N7990: length 4.4
  Top Layer w0.508: U6.7 72.51,17.54 R33.1
$1N7994: length 2.5
  Top Layer w0.508: U6.1 R39.1
$1N8746: length 6.9
  Top Layer w0.305: U7.3 63.84,15.65 63.39,15.21 ; 63.39,15.21 R41.1 ; 63.39,15.21 R40.1 64.3,12.82 U8.3
$1N8820: length 12.7
  Top Layer w0.508: C5.1 R8.2 ; C5.1 R1.1 ; C5.1 8.01,18.67 U16.5 10.42,17.66 U16.3
$1N9182: length 10.3
  Top Layer w0.305: U7.4 68.06,15.63 68.57,15.51 68.95,15 69.33,12.71 70.09,12.08 71.36,11.95 72.12,12.08 R33.2
  Top Layer w0.508: R39.2 R33.2
$1N9199: length 8.2
  Top Layer w0.305: U15.3 37.95,27.42 39.19,27.42 39.49,27.12 39.49,23.46 R18.2
  Top Layer w0.508: U15.3 R19.1
$1N9268: length 32.4
  Top Layer w0.508: U15.7 R27.2 53.72,37.33 68.57,37.33 69.84,38.6 R25.2
$1N9446: length 14
  Top Layer w0.305: R28.1 52.84,7.74 43.18,7.74 40.84,10.07 U3.1
$1N9447: length 11.4
  Top Layer w0.305: U2.1 30.12,10.93 R20.1
$1N9448: length 14.4
  Top Layer w0.308: 42.14,10.93 R31.1
$1N9449: length 18.2
  Top Layer w0.308: U2.3 39.35,10.29 40.76,8.88 ; v1(42.92,9.39) R24.1
  Bottom Layer w0.308: v1(40.63,8.88) v1(42.92,9.39)
$1N9718: length 11.6
  Top Layer w0.305: v1(64.13,11.55) 67.43,11.55 67.54,11.66 U8.4
  Top Layer w0.508: v1(62.1,10.02) R24.2
  Bottom Layer w0.305: v1(64.13,11.55) v1(62.1,10.02)
$1N10353: length 3.8
  Top Layer w0.305: 42.14,12.61 42.38,15.08 U14.5
$1N10358: length 5.8
  Top Layer w0.305: U2.4 39.46,15.96 39.21,16.98 U14.3
$1N10407: length 10.4
  Top Layer w0.305: U15.1 37.94,33.11 37.68,33.36 U1.1 R15.2
  Top Layer w0.508: R15.2 R16.2 ; R30.2 U15.1
$1N10420: length 5.9
  Top Layer w0.305: U1.3 R15.1
  Top Layer w0.508: R17.2 R16.1 R15.1
$1N10921: length 3.2
  Bottom Layer w0.254: FPC1.1 40.64,73.63 39.24,73.63 C28.1
$1N10922: length 3.7
  Bottom Layer w0.254: FPC1.2 41.64,73.7 40.44,74.9 40.44,76 C27.2
$1N10923: length 3.5
  Bottom Layer w0.254: C27.1 41.96,75.91 41.96,74.9 42.64,74.22 FPC1.3
$1N11049: length 1.5
  Top Layer w0.508: R7.2 R6.1
$1N14605: length 7.7
  Top Layer w0.305: 64.8,14.99 v1(64.8,14.87) 65.31,14.23 U8.1 ; v1(64.49,17.2) R34.1 64.84,17.86 U7.1
  Bottom Layer w0.305: v1(64.8,14.87) v1(64.49,17.2)
$1N14739: length 17
  Top Layer w0.508: R9.2 R12.2 ; R22.1 14.01,6.72 13.97,6.67
  Top Layer w1: 11.75,10.3 13.97,8.09 RF1.5
$1N14745: length 10
  Top Layer w0.508: R22.2 27.42,6.72 R20.2 27.68,3.04 RF2.5
$1N14751: length 10.7
  Top Layer w0.508: 53.08,5.2 RF3.5 ; 53.08,5.2 54.48,6.59 R32.1 ; 53.08,5.2 53.08,6.22 R28.2
$1N14766: length 44.2
  Top Layer w0.305: R41.2 61.89,15.2 61.89,13.72
  Top Layer w0.508: R31.2 61.74,13.58 61.89,13.72 ; R32.2 66.74,6.59 66.8,6.66 ; R41.2 R34.2 ; C19.2 61.84,22.11 62.09,22.62 63.49,22.75 65.27,22.49 66.66,21.22 68.31,19.83 70.84,19.13 U6.2
  Top Layer w1: RF4.5 66.8,6.97 61.21,12.56 61.21,13.45 61.34,13.58
$1N18202: length 2.6
  Top Layer w0.508: R38.2 34.54,63 U4.16
$1N18206: length 2.5
  Top Layer w0.508: 37.08,60.96 36.95,61.09 R37.2
$1N18210: length 2.5
  Top Layer w0.508: 39.62,60.96 39.75,61.09 R36.2
$1N18396: length 3.6
  Top Layer w0.508: R26.1 R27.1 U15.6
$1N18471: length 5.2
  Top Layer w0.508: R19.2 C13.1 R17.1
$1N18482: length 4
  Top Layer w0.508: R21.1 46.07,25.18 ; 46.07,25.18 C29.1 ; 46.07,25.18 R26.2
$1N18491: length 1.6
  Top Layer w0.305: U1.4 39.99,32.08 R23.1
$1N18530: length 8.4
  Top Layer w0.305: R23.2 41.78,31.8 41.78,26.55 42.2,26.12 U15.5
  Top Layer w0.508: R21.2 U15.5
$1N22517: length 14
  Top Layer w0.508: R36.1 35.27,69.37 SW5.2
  Top Layer w2: SW5.1 SW5.2
$1N22556: length 22
  Top Layer w0.508: SW6.2 24.45,67.61 25.9,66.16 35.68,66.16 ; R37.1 35.68,66.16
  Top Layer w2: SW6.1 SW6.2
$1N22633: length 28.7
  Top Layer w0.508: R38.1 17.77,64.89 14.93,67.73 SW7.2
  Top Layer w2: SW7.2 SW7.1

## Copper pours and planes (outline as drawn; the poured copper is in the pictures)
GND on Top Layer: 47.11,95.11 49.27,95.11 49.27,92.83 47.11,92.83
GND on Top Layer: 0,5.48 80,5.48 80,0 0,0
GND on Top Layer: 55.11,95 57.31,95 57.31,92.83 55.11,92.83
GND on Bottom Layer: 0,100 80,100 80,0 0,0
VCC on Top Layer: 5.94,60.82 11.68,60.82 11.68,57.9 5.94,57.9
$1N8746 on Top Layer: 63.06,15.87 64.02,15.87 64.02,13.06 63.06,13.06
$1N14605 on Top Layer: 63.04,21.81 64.01,21.81 64.01,17.48 63.04,17.48
$1N14766 on Top Layer: 61.36,21.86 62.31,21.86 62.31,17.45 61.36,17.45
$1N14766 on Top Layer: 61.25,15.87 62.21,15.87 62.21,13.06 61.25,13.06

## Text on the board
Top Silkscreen Layer: HC | HP | LP | LC
